# Altium schematic sheet Connections.SchDoc
size A; SheetNumber: 2; SheetTotal: 2
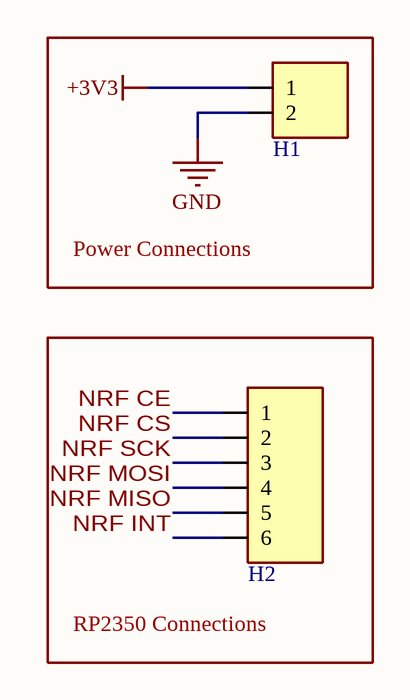
[diagram p0: Connections.SchDoc]

## Parts
H1  1x2 Male  [[Header] Shrouded 1x2 Male]  (value not drawn)
H2  [Header] Shrouded 1x6 Male  [[Header] Shrouded 1x6 Male]  (value not drawn)

## Blocks framed on the sheet
Power Connections: H1
RP2350 Connections: H2

## Nets
+3V3: H1.1
GND: H1.2
NRF CE: H2.1
NRF CS: H2.2
NRF INT: H2.6
NRF MISO: H2.5
NRF MOSI: H2.4
NRF SCK: H2.3

## Library data of the parts
H1 = [Header] Shrouded 1x2 Male: 0705430036 / Mates with 0050579402; Supplier 1: DigiKey; Supplier 2: DigiKey; Supplier Part Number 2: WM2900-ND; Supplier Part Number 1: WM4824-ND
H2 = [Header] Shrouded 1x6 Male: 0705430005 / Mates with 0050579406; Supplier 1: DigiKey; Supplier 2: DigiKey; Supplier Part Number 1: WM4804-ND; Supplier Part Number 2: WM2904-ND